# EAGLE design GlucometerV2.3 (EAGLE 7.2.0)
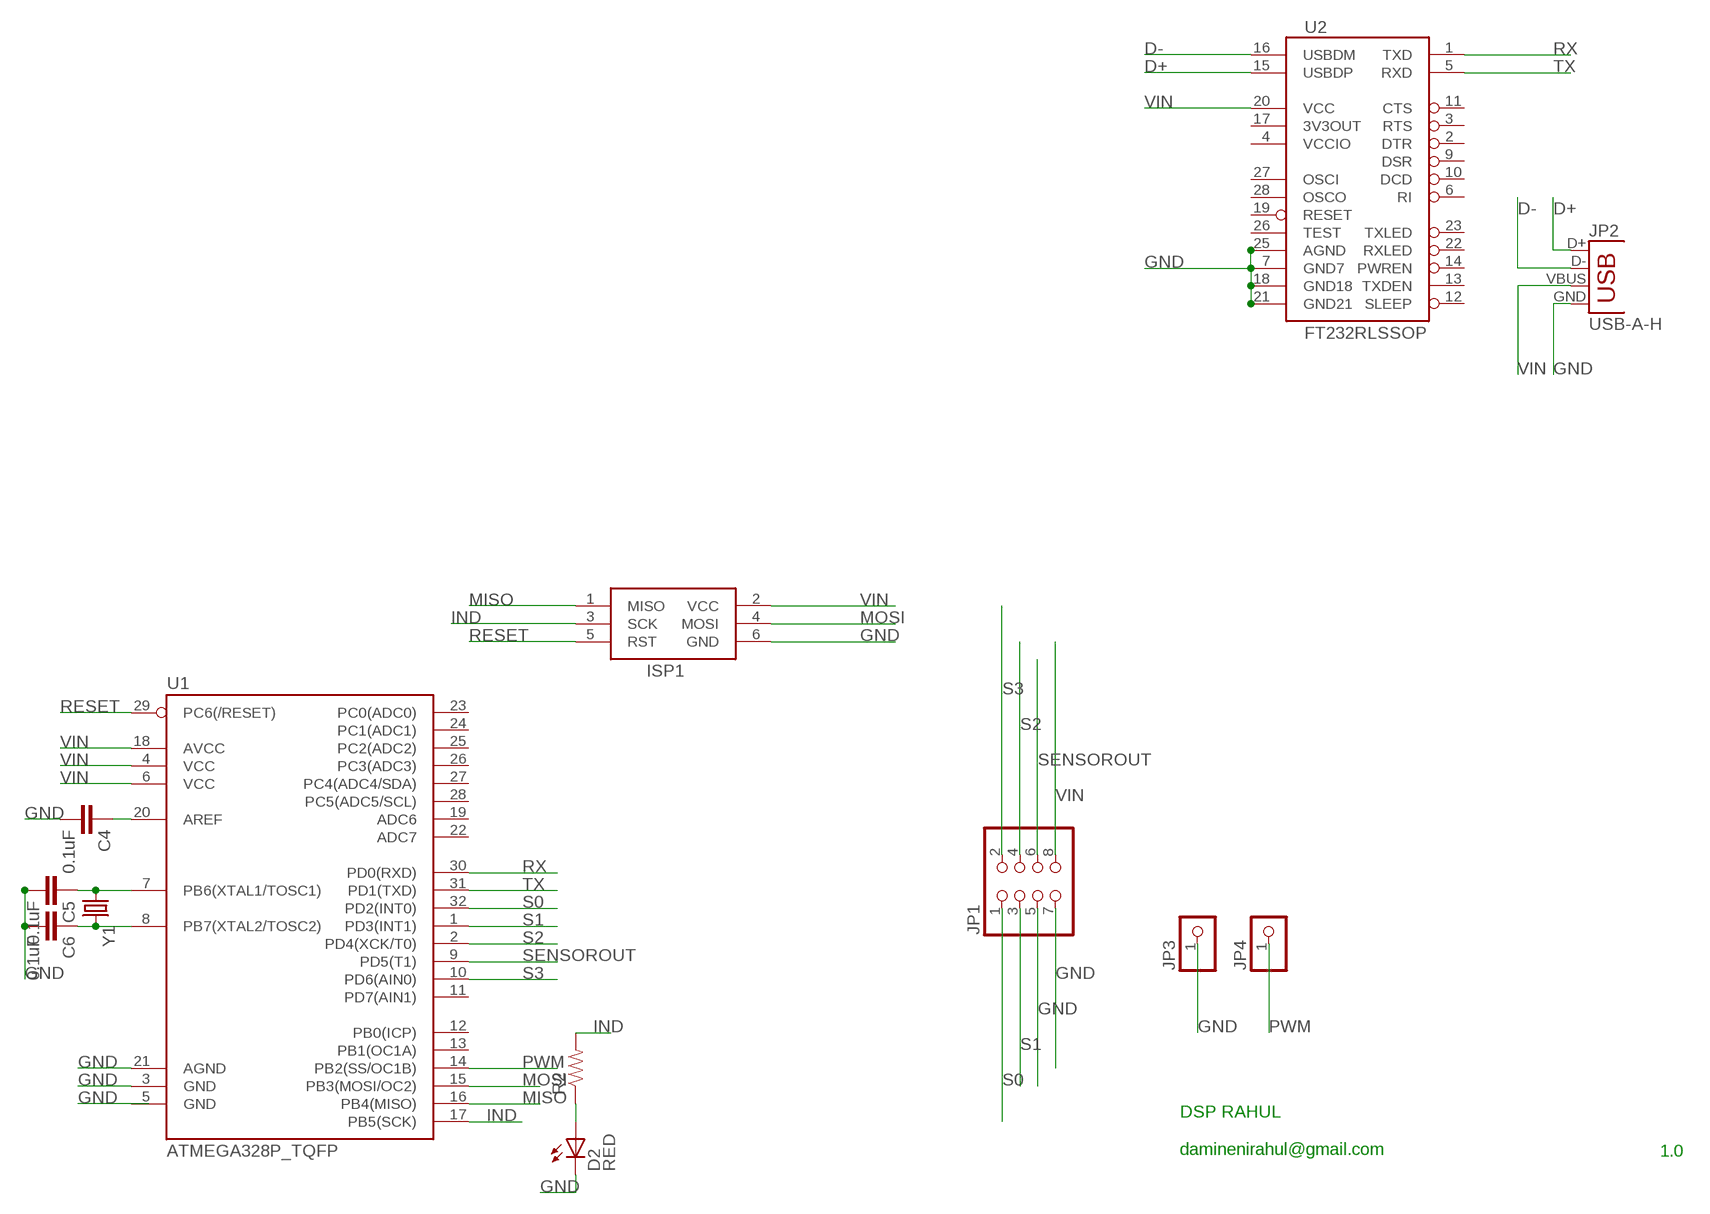
[diagram p0: schematic, sheet 1]

## Parts
C4  0.1uF  0.1UF-25V(+80/-20%)(0603)  [0603-CAP]
C5  0.1uF  0.1UF-25V(+80/-20%)(0603)  [0603-CAP]
C6  0.1uF  0.1UF-25V(+80/-20%)(0603)  [0603-CAP]
D2  RED  LEDCHIPLED_1206  [CHIPLED_1206]
ISP1  AVRISP-6  [AVRISP]
JP1  PINHD-2X4  [2X04]
JP2  USB-A-H  [USB-A-H]
JP3  PINHD-1X1  [1X01]
JP4  PINHD-1X1  [1X01]
R2  RESISTOR1206  [1206]
U1  ATMEGA328P_TQFP  [TQFP32-08]
U2  FT232RLSSOP  [SSOP28DB]
Y1  CRYSTALHC49UV  [HC49U-V]

## Nets
D+: JP2.D+ U2.15(USBDP)
D-: JP2.D- U2.16(USBDM)
GND: C4.2 C5.2 C6.2 D2.C ISP1.6(GND) JP1.5 JP1.7 JP2.GND JP3.1 U1.3(GND) U1.21(AGND) U2.7(GND7) U2.18(GND18) U2.21(GND21) U2.25(AGND)
IND: ISP1.3(SCK) R2.2 U1.17(PB5(SCK))
MISO: ISP1.1(MISO) U1.16(PB4(MISO))
MOSI: ISP1.4(MOSI) U1.15(PB3(MOSI/OC2))
N$1: C4.1 U1.20(AREF)
N$2: D2.A R2.1
N$3: C5.1 U1.7(PB6(XTAL1/TOSC1)) Y1.1
N$5: C6.1 U1.8(PB7(XTAL2/TOSC2)) Y1.2
PWM: JP4.1 U1.14(PB2(SS/OC1B))
RESET: ISP1.5(RST) U1.29(PC6(/RESET))
RX: U1.30(PD0(RXD)) U2.1(TXD)
S0: JP1.1 U1.32(PD2(INT0))
S1: JP1.3 U1.1(PD3(INT1))
S2: JP1.4 U1.2(PD4(XCK/T0))
S3: JP1.2 U1.10(PD6(AIN0))
SENSOROUT: JP1.6 U1.9(PD5(T1))
TX: U1.31(PD1(TXD)) U2.5(RXD)
VIN: ISP1.2(VCC) JP1.8 JP2.VBUS U1.4(VCC) U1.6(VCC) U1.18(AVCC) U2.20(VCC)
Unconnected: U1.5(GND) U1.11(PD7(AIN1)) U1.12(PB0(ICP)) U1.13(PB1(OC1A)) U1.19(ADC6) U1.22(ADC7) U1.23(PC0(ADC0)) U1.24(PC1(ADC1)) U1.25(PC2(ADC2)) U1.26(PC3(ADC3)) U1.27(PC4(ADC4/SDA)) U1.28(PC5(ADC5/SCL)) U2.2(DTR) U2.3(RTS) U2.6(RI) U2.9(DSR) U2.10(DCD) U2.11(CTS) U2.12(SLEEP) U2.13(TXDEN) U2.14(PWREN) U2.17(3V3OUT) U2.19(RESET) U2.22(RXLED) U2.23(TXLED) U2.26(TEST) U2.27(OSCI) U2.28(OSCO)

## Notes on the sheet
- 1.0
- DSP RAHUL
  
  daminenirahul@gmail.com

## Power pins joined to a net without a drawn wire
VCCIO: U2.4(VCCIO)

## Library data of the parts
C4-C6 = SparkFun-Capacitors:0.1UF-25V(+80/-20%)(0603): CAP-00810 Ceramic Standard decoupling cap; PROD_ID: CAP-00810
D2 = adafruit:LED: LED OSRAM: - CHIPLED LG R971, LG N971, LY N971, LG Q971, LY Q971, LO R971, LY R971 LH N974, LH R974 LS Q976, LO Q976, LY Q976 LO Q996 - Hyper CHIPLED LW Q18S LB Q993, LB Q99A, LB R99A - SideLED LS A670, LO A670, LY A670, LG A670, LP A670 LB A673, LV A673, LT A673, LW A673 LH A674 LY A675 LS A676, LA A676, LO A676, LY A676, LW A676 LS A679, LY A679, LG A679 - Hyper Micro SIDELED® LS Y876, LA Y876, LO Y876, LY Y876 LT Y87S - SmartLED LW L88C, LW L88S LB L89C, LB L89S, LG L890 LS L89K, LO L89K, LY L89K LS L896, LA L896, LO L896, LY L896 - TOPLED LS T670, LO T670, LY T670, LG T670, LP T670 LSG T670, LSP T670, LSY T670, LOP T670, LYG T670 LG T671, LOG T671, LSG T671 LB T673, LV T673, LT T673, LW T673 LH T674 LS T676, LA T676, LO T676, LY T676, LB T676, LH T676, LSB T676, LW T676 LB T67C, LV T67C, LT T67C, LS T67K, LO T67K, LY T67K, LW E67C LS E67B, LA E67B, LO E67B, LY E67B, LB E67C, LV E67C, LT E67C LW T67C LS T679, LY T679, LG T679 LS T770, LO T770, LY T770, LG T770, LP T770 LB T773, LV T773, LT T773, LW T773 LH T774 LS E675, LA E675, LY E675, LS T675 LS T776, LA T776, LO T776, LY T776, LB T776 LHGB T686 LT T68C, LB T68C - Hyper Mini TOPLED® LB M676 - Mini TOPLED Santana® LG M470 LS M47K, LO M47K, LY M47K Source: http://www.osram.convergy.de/
ISP1 = adafruit:AVRISP: AVR ISP HEADER Standard 6 pin header for AVR programming
JP1 = adafruit:PINHD-2X4: PIN HEADER
JP2 = SparkFun-Connectors:USB: USB Connectors USB-B-PTH is fully proven SKU : PRT-00139/CONN-08278 USB-miniB is fully proven SKU : PRT-00587 USB-A-PCB is untested. USB-A-H is throughly reviewed, but untested. Spark Fun Electronics SKU : PRT-00437 USB-B-SMT is throughly reviewed, but untested. Needs silkscreen touching up. USB-A-S has not been used/tested USB-MB-H has not been used/tested USB-MICROB has been used. CONN-09505; PROD_ID: CONN-08367
JP3 JP4 = adafruit:PINHD-1X1: Pin header 1x1 for 0.1" spacing With round pins
R2 = SparkFun-Resistors:RESISTOR: Resistor Basic schematic elements and footprints for 0603, 1206, and PTH resistors.
U1 = SparkFun-DigitalIC:ATMEGA328P_TQFP; PROD_ID: IC-09069
U2 = SparkFun-DigitalIC:FT232RL: USB UART FT232RL 4th Generation USB UART (USB <-> Serial) Controller. Spark Fun Electronics SKU : COM-00650 Production SKU IC-00870; PROD_ID: IC-00870
Y1 = SparkFun-FreqCtrl:CRYSTAL: Various standard crystals. Proven footprints.

## Board
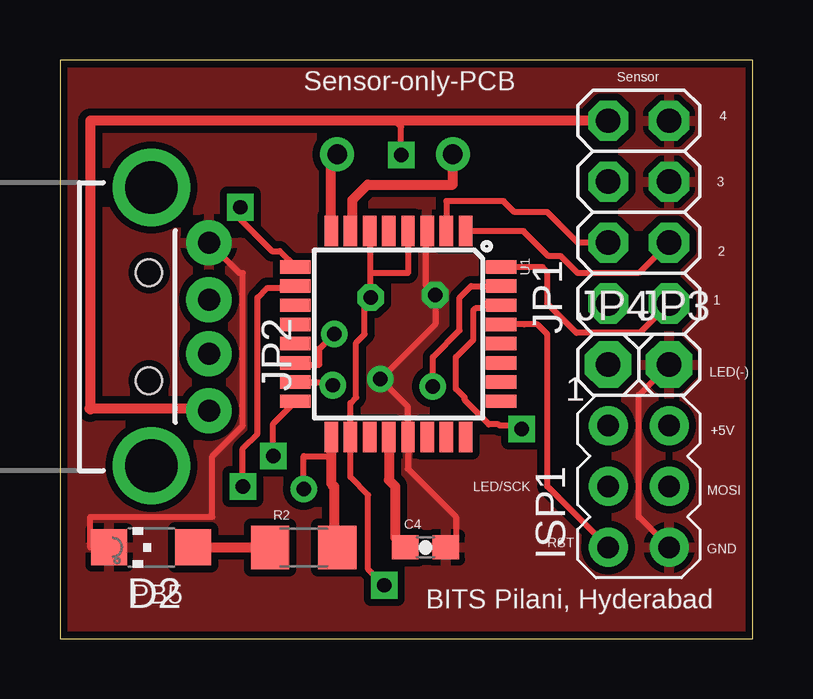
[diagram p1: board, top side]
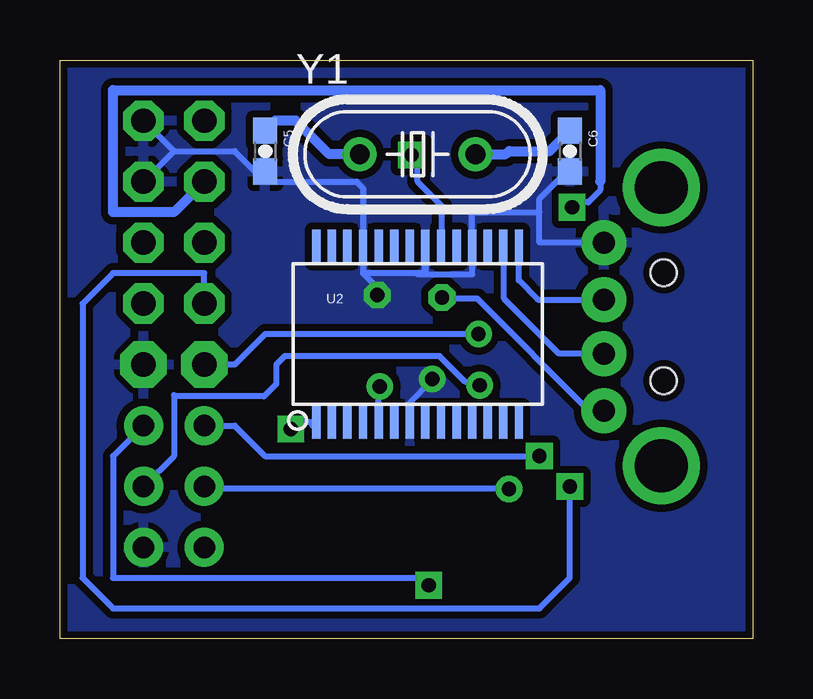
[diagram p2: board, bottom side, seen from below]

Size 28.88 x 24.12 mm. Coordinates in mm from the lower left corner, seen from the top.
Outline: 0,0 28.88,0 28.88,24.12 0,24.12 0,0
Copper layers (1*16): Top 0.035mm / dielectric 1.5mm / Bottom 0.035mm
Design rules "SparkFun": minimum track width 8mil, minimum drill 20mil, track to track 8mil, track to pad 8mil, pad to pad 8mil, via to via 8mil, smd to smd 8mil, copper to edge 8mil, drill to drill 8mil, minimum pad ring 12mil, minimum via ring 10mil, stop-mask expansion 4mil, vias tented up to drill 20mil, thermal gap 10mil

### Footprints (pad centres in the part's own frame; a part is rotated, then mirrored left to right if it is on the bottom)
0603-CAP = smd 1.1 x 1: 1 -0.85,0; 2 0.85,0
CHIPLED_1206 = smd 1.5 x 1.5: A 0,-1.75; C 0,1.75
AVRISP = drill 0.9 pad 1.626: 1 -1.27,2.54; 2 1.27,2.54; 3 -1.27,0; 4 1.27,0; 5 -1.27,-2.54; 6 1.27,-2.54
2X04 = drill 1.016 pad 1.676 octagon: 1 -3.81,-1.27; 2 -3.81,1.27; 3 -1.27,-1.27; 4 -1.27,1.27; 5 1.27,-1.27; 6 1.27,1.27; 7 3.81,-1.27; 8 3.81,1.27
USB-A-H = drill 0.914 pad 1.88: D+ 2.4,1.127; D- 2.4,-1.127; GND 2.4,3.5; VBUS 2.4,-3.5 | drill 2.2: GND2 0,-5.8; GND3 0,5.8 | hole 1.1: -0.1,2.25; -0.1,-2.25
1X01 = drill 1.016 pad 1.93 octagon: 1 0,0
1206 = smd 1.6 x 1.8: 1 -1.4,0; 2 1.4,0
TQFP32-08 = smd 1.27 x 0.559: 1 -4.293,2.8; 2 -4.293,2; 3 -4.293,1.2; 4 -4.293,0.4; 5 -4.293,-0.4; 6 -4.293,-1.2; 7 -4.293,-2; 8 -4.293,-2.8; 17 4.293,-2.8; 18 4.293,-2; 19 4.293,-1.2; 20 4.293,-0.4; 21 4.293,0.4; 22 4.293,1.2; 23 4.293,2; 24 4.293,2.8 | smd 0.559 x 1.27: 9 -2.8,-4.293; 10 -2,-4.293; 11 -1.2,-4.293; 12 -0.4,-4.293; 13 0.4,-4.293; 14 1.2,-4.293; 15 2,-4.293; 16 2.8,-4.293; 25 2.8,4.293; 26 2,4.293; 27 1.2,4.293; 28 0.4,4.293; 29 -0.4,4.293; 30 -1.2,4.293; 31 -2,4.293; 32 -2.8,4.293
SSOP28DB = smd 0.348 x 1.397: 1 -4.225,-3.656; 2 -3.575,-3.656; 3 -2.925,-3.656; 4 -2.275,-3.656; 5 -1.625,-3.656; 6 -0.975,-3.656; 7 -0.325,-3.656; 8 0.325,-3.656; 9 0.975,-3.656; 10 1.625,-3.656; 11 2.275,-3.656; 12 2.925,-3.656; 13 3.575,-3.656; 14 4.225,-3.656; 15 4.225,3.656; 16 3.575,3.656; 17 2.925,3.656; 18 2.275,3.656; 19 1.625,3.656; 20 0.975,3.656; 21 0.325,3.656; 22 -0.325,3.656; 23 -0.975,3.656; 24 -1.625,3.656; 25 -2.275,3.656; 26 -2.925,3.656; 27 -3.575,3.656; 28 -4.225,3.656
HC49U-V = drill 0.813: 1 -2.413,0; 2 2.413,0

### Placement (x,y rotation side)
C4  15.24,3.81 0 top
C5  20.32,20.32 270 bottom
C6  7.62,20.32 270 bottom
D2  3.81,3.81 90 top
ISP1  24.13,6.35 0 top
JP1  24.13,17.78 90 top
JP2  3.81,13.01 0 top
JP3  25.4,11.43 0 top
JP4  22.86,11.43 0 top
R2  10.16,3.81 0 top
U1  14.11,12.7 270 top
U2  13.97,12.7 0 bottom
Y1  13.97,20.19 0 bottom

### Tracks (layer width: path | path; a pad name or v marks a point on that pad's centre or on a via)
D+
  Bottom 0.254: U2.15 9.75,16.35 9.75,14.94 8.96,14.14 JP2.D+
D-
  Bottom 0.254: JP2.D- 8.07,11.88 10.36,14.17 10.36,16.32 U2.16
GND  (via drill 0.6)
  Top 0.254: ISP1.6 24.13,5.08 24.13,10.16 JP3.1 | C4.2 16.51,4.23 16.51,5.08 14.51,7.08 U1.21 14.51,9.67 v13.36,10.82 15.65,13.11 v15.65,14.33 15.24,14.73 15.24,16.92 U1.3 | D2.C 1.27,3.81 1.27,5.08 6.35,5.08 6.35,7.62 7.62,8.89 7.62,15.24 7.48,15.24 JP2.GND
  Bottom 0.254: JP1.5 24.13,20.32 | 24.13,20.32 21.59,20.32 20.74,19.47 C5.2 19.9,19.05 16.51,19.05 16.25,18.79 U2.25 16.25,15.24 | 13.66,15.24 13.66,16.34 U2.21 13.64,15.24 13.66,15.24 | 13.66,15.24 13.97,15.24 | 13.97,15.24 16.25,15.24 | v13.36,10.82 13.36,10.77 14.33,9.8 14.33,9.04 U2.7 | v15.65,14.33 15.8,14.79 16.25,15.24 | JP2.GND 8.89,16.51 8.89,17.78 | 8.89,17.78 8.89,18.34 7.76,19.47 C6.2 | 13.97,15.24 13.97,15.19 11.68,15.19 11.68,16.36 U2.18 11.7,17.78 8.89,17.78 | JP1.7 24.13,20.32
  pour Top (isolate 0.305): 0,0 0,24.13 29.21,24.13 29.21,0
  pour Bottom (isolate 0.305): 0,24.13 29.21,24.13 29.21,0 0,0
IND  (via drill 0.6)
  Top 0.254: v10.16,6.25 10.16,7.62 11.31,7.62
  Top 0.406: U1.17 11.31,7.62 11.31,6.47 11.43,6.35 11.43,3.94 R2.2
  Bottom 0.254: v10.16,6.25 22.76,6.25 ISP1.3
MISO  (via drill 0.6)
  Top 0.254: v8.89,7.62 8.89,8.97 U1.16
  Bottom 0.254: ISP1.1 21.59,8.89 20.32,7.62 v8.89,7.62
MOSI  (via drill 0.6)
  Top 0.254: U1.15 9.85,10.67 11.28,10.67 v11.38,10.57
  Bottom 0.254: ISP1.4 24.13,7.62 24.13,10.16 24.08,10.11 20.37,10.11 19.86,10.62 19.86,11.43 19.51,11.79 13.06,11.79 11.99,10.72 11.53,10.72 v11.38,10.57
N$1
  Top 0.406: U1.20 13.71,6.61 13.97,6.35 13.97,4.23 C4.1
N$2
  Top 0.406: D2.A R2.1
N$3
  Top 0.406: U1.7 12.19,17.07 12.19,18.29 12.83,18.92 16.38,18.92 Y1.1
  Bottom 0.406: Y1.1 17.65,20.19 19.05,21.59 19.9,21.59 C5.1
N$5
  Top 0.406: U1.8 11.31,20.19 Y1.2
  Bottom 0.406: Y1.2 10.29,20.19 10.16,20.32 8.47,20.32 C6.1
PWM  (via drill 0.6)
  Top 0.254: U1.14 9.89,11.43 10.82,11.43 10.82,12.09 v11.43,12.7
  Bottom 0.254: v11.43,12.7 20.32,12.7 21.59,11.43 JP4.1
RESET
  Top 0.254: U1.29 19.35,13.1 19.36,13.11 19.91,13.11 20.32,12.7 20.32,6.35 ISP1.5
RX  (via drill 0.6)
  Top 0.254: U1.30 18.33,13.97 17.78,13.97 17.58,13.77 17.32,13.77 17.22,13.67 17.22,12.45 16.51,11.73 16.51,10.41 16.87,10.06 16.87,9.96 17.88,8.94 18.29,8.94 18.34,8.89 19.05,8.89 19.2,8.74 v19.25,8.74
  Bottom 0.254: 18.35,8.89 U2.1 18.95,9.04 v19.25,8.74
S0
  Top 0.254: U1.32 20.12,15.49 20.32,15.29 20.32,13.97 21.54,12.75 24.18,12.75 JP1.1
S1
  Top 0.254: JP1.3 24.13,15.24 21.59,15.24 20.88,15.95 20.37,15.95 19.33,16.99 U1.1
S2
  Top 0.254: U1.2 16.11,18.23 16.1,18.24 18.49,18.24 18.95,17.78 20.32,17.78 21.59,16.51 JP1.4
S3  (via drill 0.6)
  Top 0.254: 9.85,14.73 U1.10 9.75,14.63 8.64,14.63 8.23,14.22 8.23,8.53 7.62,7.93 v7.62,6.35
  Bottom 0.254: JP1.2 22.86,15.24 26.67,15.24 27.94,13.97 27.94,2.54 26.67,1.27 8.89,1.27 7.62,2.54 v7.62,6.35
SENSOROUT  (via drill 0.6)
  Top 0.254: v7.52,17.98 7.52,17.47 8.84,16.15 9.16,16.15 U1.9
  Bottom 0.254: 6.35,19.05 6.35,18.69 6.86,18.19 7.32,18.19 v7.52,17.98
  Bottom 0.406: JP1.6 24.13,17.78 26.67,17.78 26.67,22.86 6.35,22.86 6.35,19.05
TX  (via drill 0.6)
  Top 0.254: U1.31 17.14,14.7 16.66,14.22 16.66,12.85 15.54,11.73 v15.54,10.52
  Bottom 0.254: U2.5 15.6,10.57 v15.54,10.52
VIN  (via drill 0.6)
  Top 0.254: v13.51,2.24 12.85,2.9 12.85,5.99 12.11,6.74 U1.18 12.11,9.82 12.34,10.06 12.34,12.34 12.7,12.7 12.7,13.97 v12.95,14.22 12.95,15.24 | v14.22,20.17 14.22,21.34 13.97,21.59 | 12.95,15.24 12.95,16.95 U1.6 | U1.4 14.51,15.24 12.95,15.24
  Top 0.406: JP2.VBUS 6.12,9.6 1.22,9.6 1.27,9.55 1.27,21.59 13.97,21.59 JP1.8
  Bottom 0.254: ISP1.2 26.67,7.62 26.67,2.54 13.82,2.54 v13.51,2.24 | U2.20 12.95,16.36 12.95,18.03 13.97,19.05 13.97,19.91 v14.22,20.17 | JP2.VBUS 6.82,9.51 11.48,14.17 12.9,14.17 v12.95,14.22

### Text on the board
tPlace: Sensor-only-PCB | Sensor | 4 | 3 | 2 | 1 | LED(-) | +5V | LED/SCK | MOSI | RST | GND | PB5 | BITS Pilani, Hyderabad